# Altium schematic sheet Sch.SchDoc
size A3
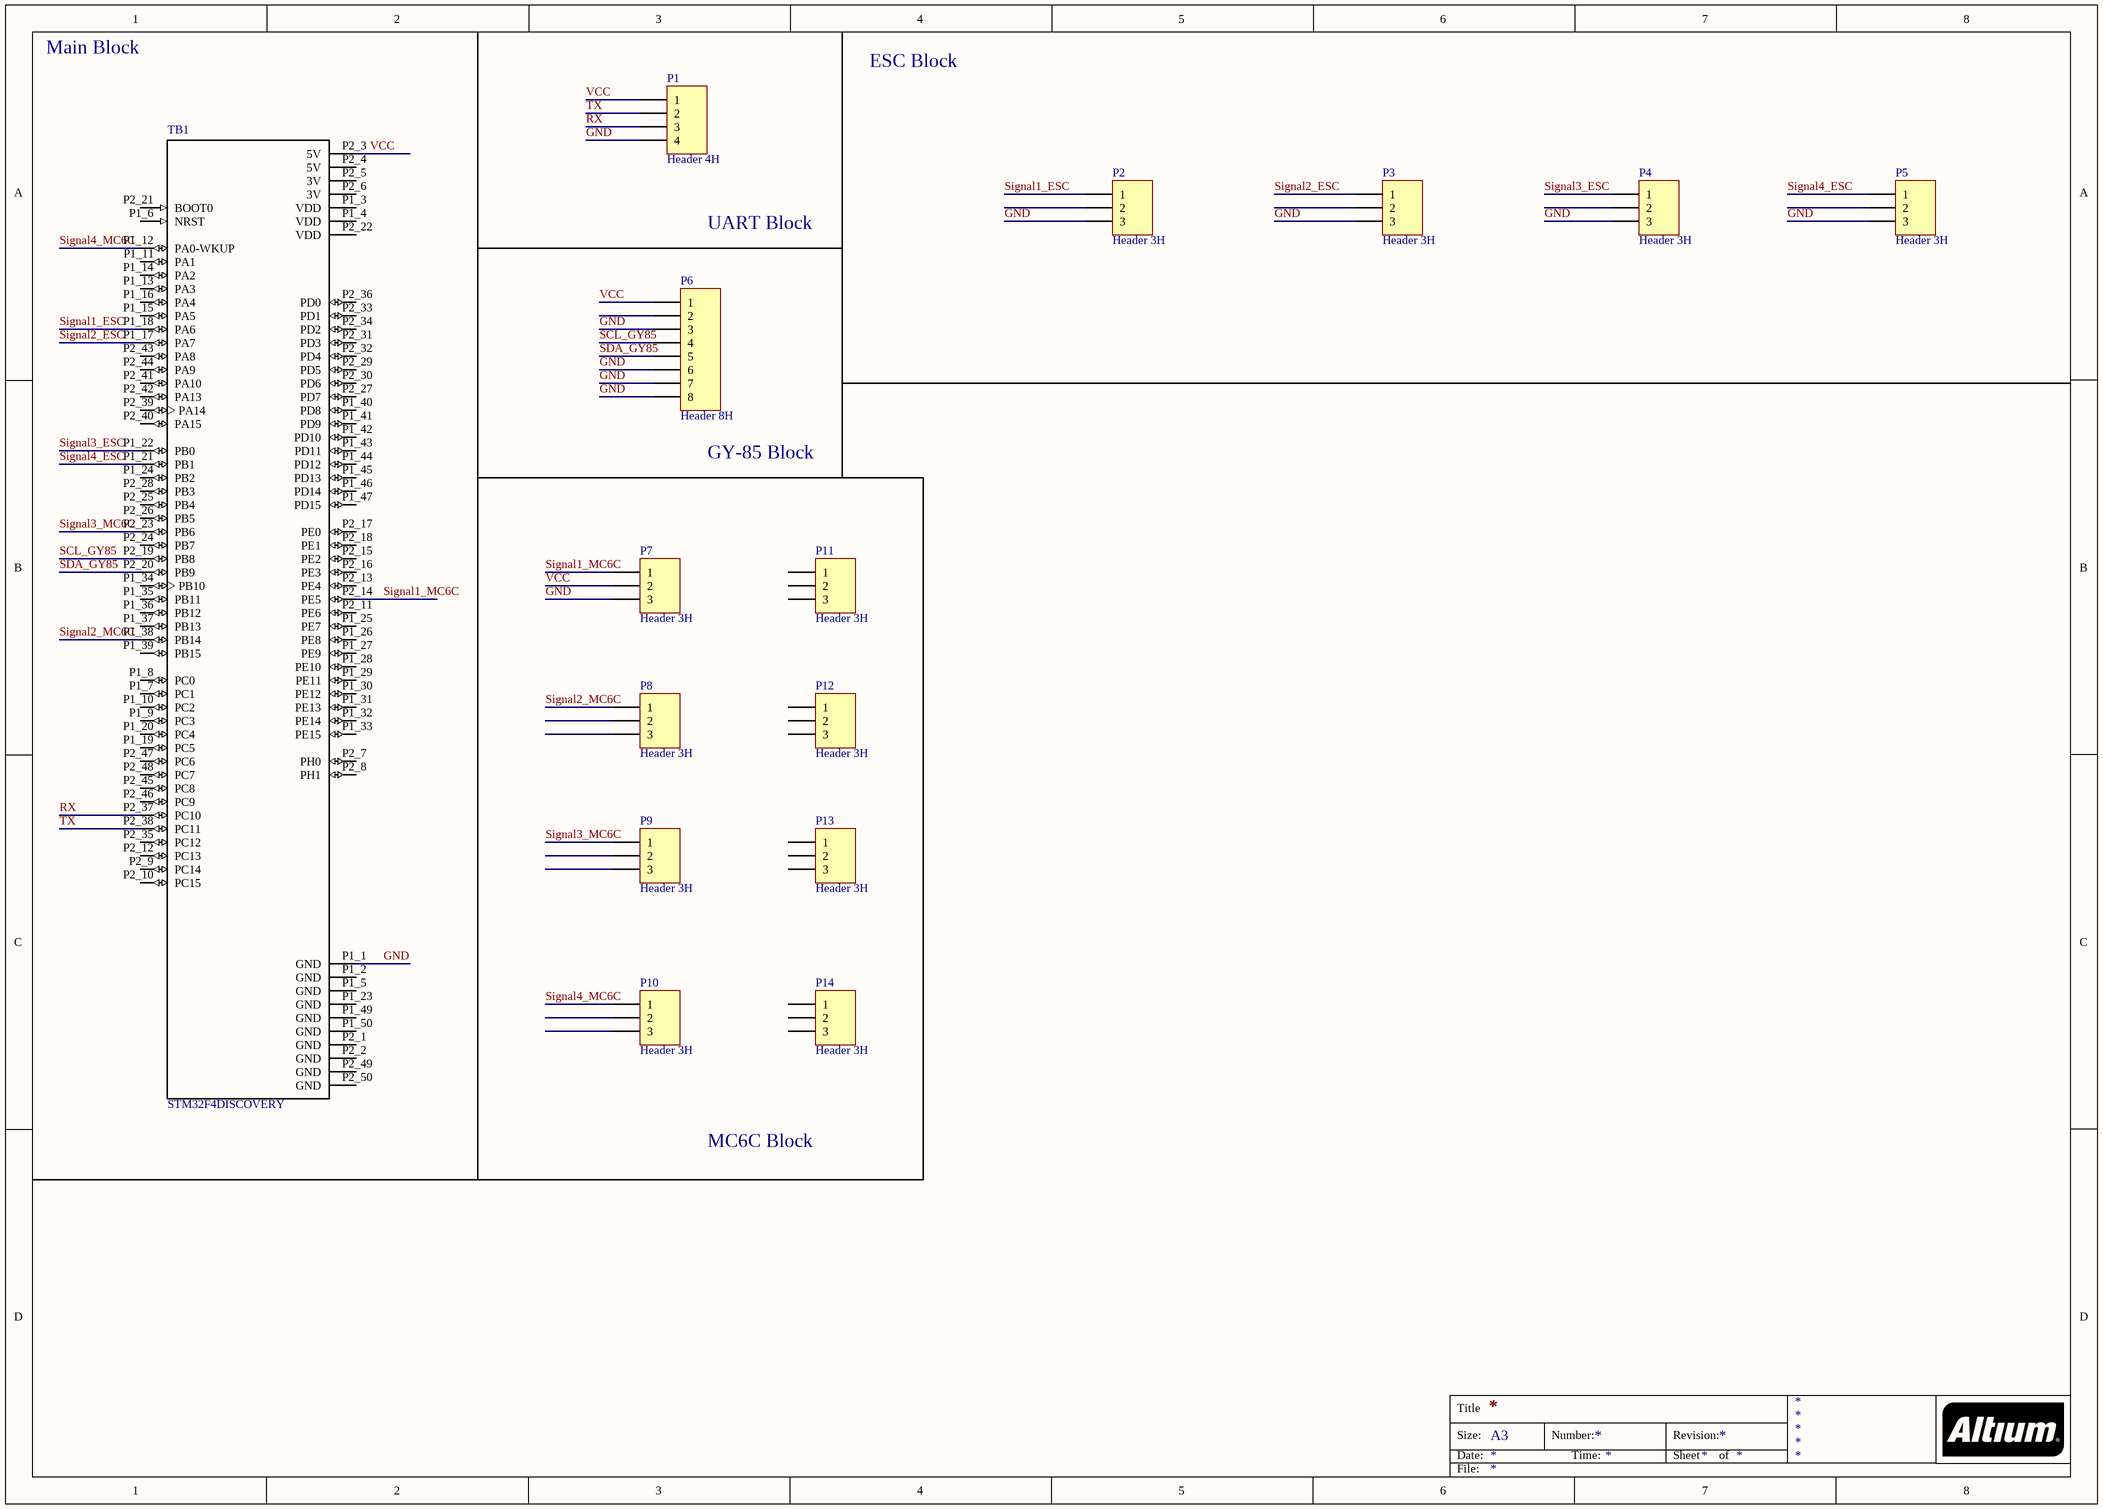
[diagram p0: Sch.SchDoc]

## Parts
P1  Header 4H  [HDR1X4H]
P2  Header 3H  [HDR1X3H]
P3  Header 3H  [HDR1X3H]
P4  Header 3H  [HDR1X3H]
P5  Header 3H  [HDR1X3H]
P6  Header 8H  [HDR1X8H]
P7  Header 3H  [HDR1X3H]
P8  Header 3H  [HDR1X3H]
P9  Header 3H  [HDR1X3H]
P10  Header 3H  [HDR1X3H]
P11  Header 3H  [HDR1X3H]
P12  Header 3H  [HDR1X3H]
P13  Header 3H  [HDR1X3H]
P14  Header 3H  [HDR1X3H]
TB1  STM32F4DISCOVERY  [*MODULE_STM32F4DISCOVERY_STM32F4DISCOVERY(Primary)]

## Nets
GND: P1.4 P2.3 P3.3 P4.3 P5.3 P6.3 P6.6 P6.7 P6.8 P7.3 TB1.P1_1(GND)
RX: P1.3 TB1.P2_37(PC10)
SCL_GY85: P6.4 TB1.P2_19(PB8)
SDA_GY85: P6.5 TB1.P2_20(PB9)
Signal1_ESC: P2.1 TB1.P1_18(PA6)
Signal1_MC6C: P7.1 TB1.P2_14(PE5)
Signal2_ESC: P3.1 TB1.P1_17(PA7)
Signal2_MC6C: P8.1 TB1.P1_38(PB14)
Signal3_ESC: P4.1 TB1.P1_22(PB0)
Signal3_MC6C: P9.1 TB1.P2_23(PB6)
Signal4_ESC: P5.1 TB1.P1_21(PB1)
Signal4_MC6C: P10.1 TB1.P1_12(PA0-WKUP)
TX: P1.2 TB1.P2_38(PC11)
VCC: P1.1 P6.1 P7.2 TB1.P2_3(5V)

Not connected (* = marked no-connect by the designer): P2 2; P3 2; P4 2; P5 2; P6 2; P8 2 3; P9 2 3; P10 2 3; P11 1 2 3; P12 1 2 3; P13 1 2 3; P14 1 2 3; TB1 P1_2(GND) P1_3(VDD) P1_4(VDD) P1_5(GND) P1_6(NRST) P1_7(PC1) P1_8(PC0) P1_9(PC3) P1_10(PC2) P1_11(PA1) P1_13(PA3) P1_14(PA2) P1_15(PA5) P1_16(PA4) P1_19(PC5) P1_20(PC4) P1_23(GND) P1_24(PB2) P1_25(PE7) P1_26(PE8) P1_27(PE9) P1_28(PE10) P1_29(PE11) P1_30(PE12) P1_31(PE13) P1_32(PE14) P1_33(PE15) P1_34(PB10) P1_35(PB11) P1_36(PB12) P1_37(PB13) P1_39(PB15) P1_40(PD8) P1_41(PD9) P1_42(PD10) P1_43(PD11) P1_44(PD12) P1_45(PD13) P1_46(PD14) P1_47(PD15) P1_49(GND) P1_50(GND) P2_1(GND) P2_2(GND) P2_4(5V) P2_5(3V) P2_6(3V) P2_7(PH0) P2_8(PH1) P2_9(PC14) P2_10(PC15) P2_11(PE6) P2_12(PC13) P2_13(PE4) P2_15(PE2) P2_16(PE3) P2_17(PE0) P2_18(PE1) P2_21(BOOT0) P2_22(VDD) P2_24(PB7) P2_25(PB4) P2_26(PB5) P2_27(PD7) P2_28(PB3) P2_29(PD5) P2_30(PD6) P2_31(PD3) P2_32(PD4) P2_33(PD1) P2_34(PD2) P2_35(PC12) P2_36(PD0) P2_39(PA14) P2_40(PA15) P2_41(PA10) P2_42(PA13) P2_43(PA8) P2_44(PA9) P2_45(PC8) P2_46(PC9) P2_47(PC6) P2_48(PC7) P2_49(GND) P2_50(GND)

## Notes on the sheet
- Main Block
- ESC Block
- UART Block
- (near P6) GY-85 Block
- MC6C Block
- Title
- Size:
- Date:
- A3
- Number:
- Time:
- Revision:
- Sheet
- of
- File:

## Library data of the parts
P1 = Header 4H: Header, 4-Pin, Right Angle; LatestRevisionDate: 17-Jul-2002; LatestRevisionNote: Re-released for DXP Platform.; Publisher: Altium Limited
P2-P5 P7-P14 = Header 3H: Header, 3-Pin, Right Angle; LatestRevisionDate: 17-Jul-2002; LatestRevisionNote: Re-released for DXP Platform.; Publisher: Altium Limited
P6 = Header 8H: Header, 8-Pin, Right Angle; LatestRevisionDate: 17-Jul-2002; LatestRevisionNote: Re-released for DXP Platform.; Publisher: Altium Limited
TB1 = STM32F4DISCOVERY: / STM32F407VGT6 Discovery STM32F4 ARMÂ® CortexÂ®-M4 MCU 32-Bit Embedded Evaluation Board /; MF: STMicroelectronics; Price: None; SnapEDA_Link: https://www.snapeda.com/parts/STM32F4DISCOVERY/STMicroelectronics/view-part/46335/?ref=snap; MP: STM32F4DISCOVERY; Availability: Unavailable; Package: None; Value: *